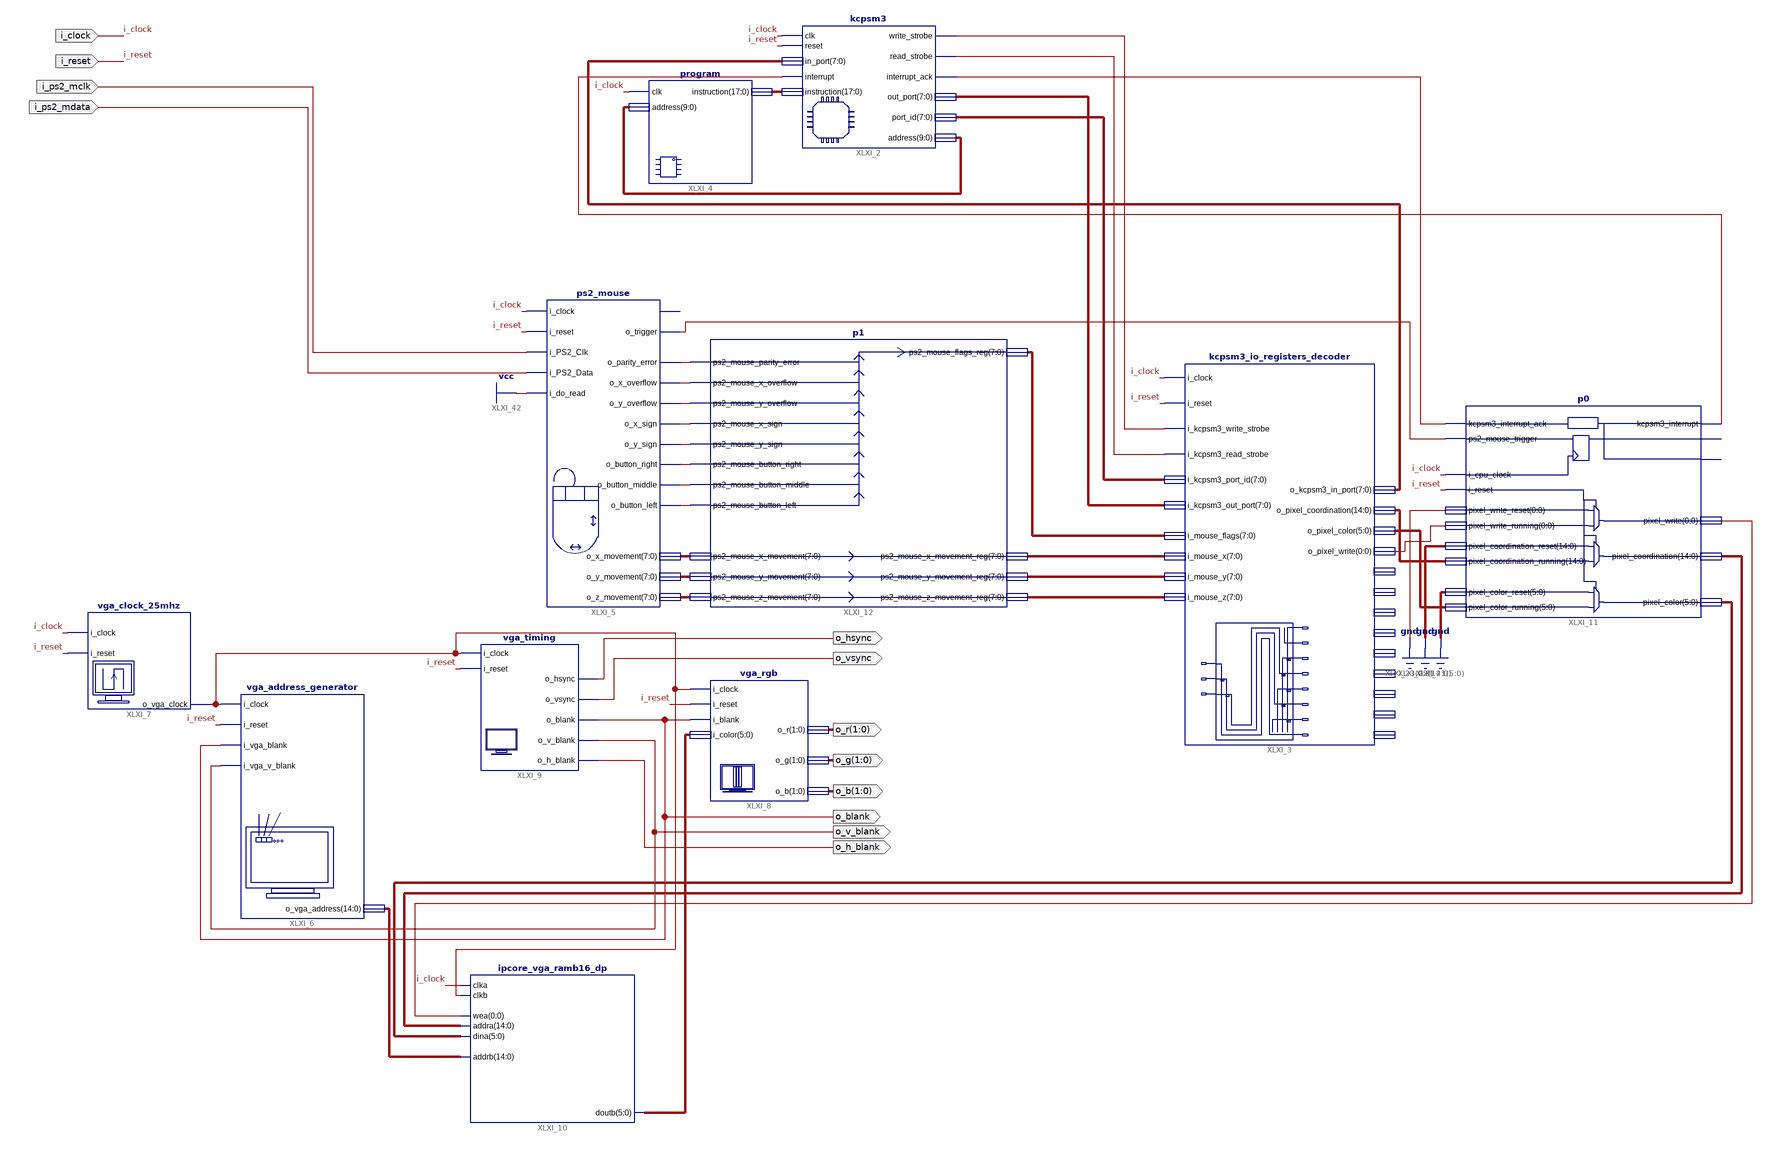
[diagram p0: schematic sheet 1]
// Xilinx ISE schematic top.sch (spartan3e) as structural Verilog: 11 symbols, 12 ports
module top (
  input  i_reset,
  input  i_clock,
  input  i_ps2_mclk,
  input  i_ps2_mdata,
  output o_vsync,
  output o_hsync,
  output o_v_blank,
  output o_blank,
  output [1:0] o_b,
  output [1:0] o_g,
  output [1:0] o_r,
  output o_h_blank
);

  wire XLXN_44, XLXN_45, XLXN_46, XLXN_47, XLXN_48, XLXN_49, XLXN_50, XLXN_51, XLXN_154, XLXN_177, XLXN_178,
       XLXN_210, XLXN_256, XLXN_302;
  wire [0:0] XLXN_203, XLXN_1112;
  wire [5:0] XLXN_149, XLXN_204, XLXN_1114;
  wire [7:0] XLXN_41, XLXN_42, XLXN_43, XLXN_52, XLXN_53, XLXN_54, XLXN_55, XLXN_179, XLXN_180, XLXN_200;
  wire [9:0] XLXN_60;
  wire [14:0] XLXN_143, XLXN_205, XLXN_1113;
  wire [17:0] XLXN_59;

  vga_timing XLXI_9 (
    .o_hsync(o_hsync), .o_vsync(o_vsync), .o_blank(o_blank), .o_v_blank(o_v_blank), .o_h_blank(o_h_blank),
    .i_clock(XLXN_154), .i_reset(i_reset));
  ipcore_vga_ramb16_dp XLXI_10 (
    .doutb(XLXN_149), .clka(i_clock), .clkb(XLXN_154), .addrb(XLXN_143), .addra(XLXN_1113), .dina(XLXN_1114),
    .wea(XLXN_1112[0]));
  vga_address_generator XLXI_6 (
    .o_vga_address(XLXN_143), .i_clock(XLXN_154), .i_reset(i_reset), .i_vga_blank(o_blank),
    .i_vga_v_blank(o_v_blank));
  vga_rgb XLXI_8 (
    .i_clock(XLXN_154), .i_reset(i_reset), .i_blank(o_blank), .i_color(XLXN_149), .o_r(o_r), .o_g(o_g),
    .o_b(o_b));
  vga_clock_25mhz XLXI_7 (.i_clock(i_clock), .i_reset(i_reset), .o_vga_clock(XLXN_154));
  p0 XLXI_11 (
    .pixel_color(XLXN_1114), .pixel_color_reset({6{1'b0}}), .pixel_color_running(XLXN_204),
    .pixel_write_reset(1'b0), .pixel_write_running(XLXN_203[0]), .pixel_coordination_reset({15{1'b0}}),
    .pixel_coordination_running(XLXN_205), .pixel_coordination(XLXN_1113), .pixel_write(XLXN_1112[0]),
    .i_reset(i_reset), .ps2_mouse_trigger(XLXN_256), .i_cpu_clock(i_clock), .kcpsm3_interrupt_ack(XLXN_210),
    .kcpsm3_interrupt(XLXN_302));  // open: ps2_mouse_do_read, ps2_mouse_trigger_4x
  \program  XLXI_4 (.clk(i_clock), .address(XLXN_60), .instruction(XLXN_59));
  ps2_mouse XLXI_5 (
    .o_x_movement(XLXN_41), .o_y_movement(XLXN_42), .o_z_movement(XLXN_43), .i_clock(i_clock),
    .i_do_read(1'b1), .i_PS2_Data(i_ps2_mdata), .i_PS2_Clk(i_ps2_mclk), .i_reset(i_reset),
    .o_trigger(XLXN_256), .o_parity_error(XLXN_44), .o_x_overflow(XLXN_45), .o_y_overflow(XLXN_46),
    .o_x_sign(XLXN_47), .o_y_sign(XLXN_48), .o_button_left(XLXN_49), .o_button_right(XLXN_50),
    .o_button_middle(XLXN_51));  // open: o_scan_ready
  p1 XLXI_12 (
    .ps2_mouse_z_movement_reg(XLXN_52), .ps2_mouse_y_movement_reg(XLXN_53),
    .ps2_mouse_x_movement_reg(XLXN_54), .ps2_mouse_flags_reg(XLXN_55), .ps2_mouse_x_movement(XLXN_41),
    .ps2_mouse_y_movement(XLXN_42), .ps2_mouse_z_movement(XLXN_43), .ps2_mouse_parity_error(XLXN_44),
    .ps2_mouse_x_overflow(XLXN_45), .ps2_mouse_y_overflow(XLXN_46), .ps2_mouse_x_sign(XLXN_47),
    .ps2_mouse_y_sign(XLXN_48), .ps2_mouse_button_right(XLXN_50), .ps2_mouse_button_middle(XLXN_51),
    .ps2_mouse_button_left(XLXN_49));
  kcpsm3_io_registers_decoder XLXI_3 (
    .i_clock(i_clock), .i_reset(i_reset), .i_kcpsm3_write_strobe(XLXN_177), .i_kcpsm3_read_strobe(XLXN_178),
    .i_kcpsm3_port_id(XLXN_179), .i_kcpsm3_out_port(XLXN_180), .o_kcpsm3_in_port(XLXN_200),
    .o_pixel_coordination(XLXN_205), .o_pixel_color(XLXN_204), .o_pixel_write(XLXN_203[0]),
    .i_mouse_z(XLXN_52), .i_mouse_y(XLXN_53), .i_mouse_x(XLXN_54), .i_mouse_flags(XLXN_55));  // open: o_test8, o_test7, o_test6, o_test5, o_test4, o_test3, o_test2, o_test1, o_test0
  kcpsm3 XLXI_2 (
    .reset(i_reset), .write_strobe(XLXN_177), .read_strobe(XLXN_178), .interrupt_ack(XLXN_210),
    .port_id(XLXN_179), .clk(i_clock), .instruction(XLXN_59), .interrupt(XLXN_302), .in_port(XLXN_200),
    .address(XLXN_60), .out_port(XLXN_180));
endmodule
